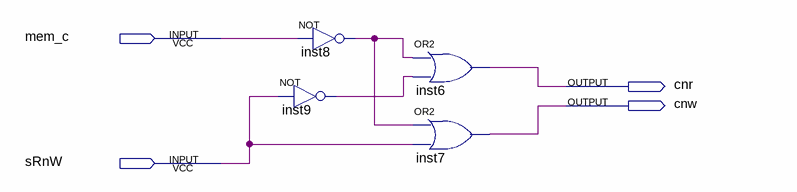
[diagram p0: schematic sheet]
// Quartus schematic cRW.bdf as structural Verilog: 4 symbols, 4 pins
module cRW (
  input  mem_c,
  input  sRnW,
  output cnr,
  output cnw
);

  wire inst8_out, inst9_out;

  not inst9 (inst9_out, sRnW);
  not inst8 (inst8_out, mem_c);
  or inst6 (cnr, inst8_out, inst9_out);
  or inst7 (cnw, inst8_out, sRnW);
endmodule
